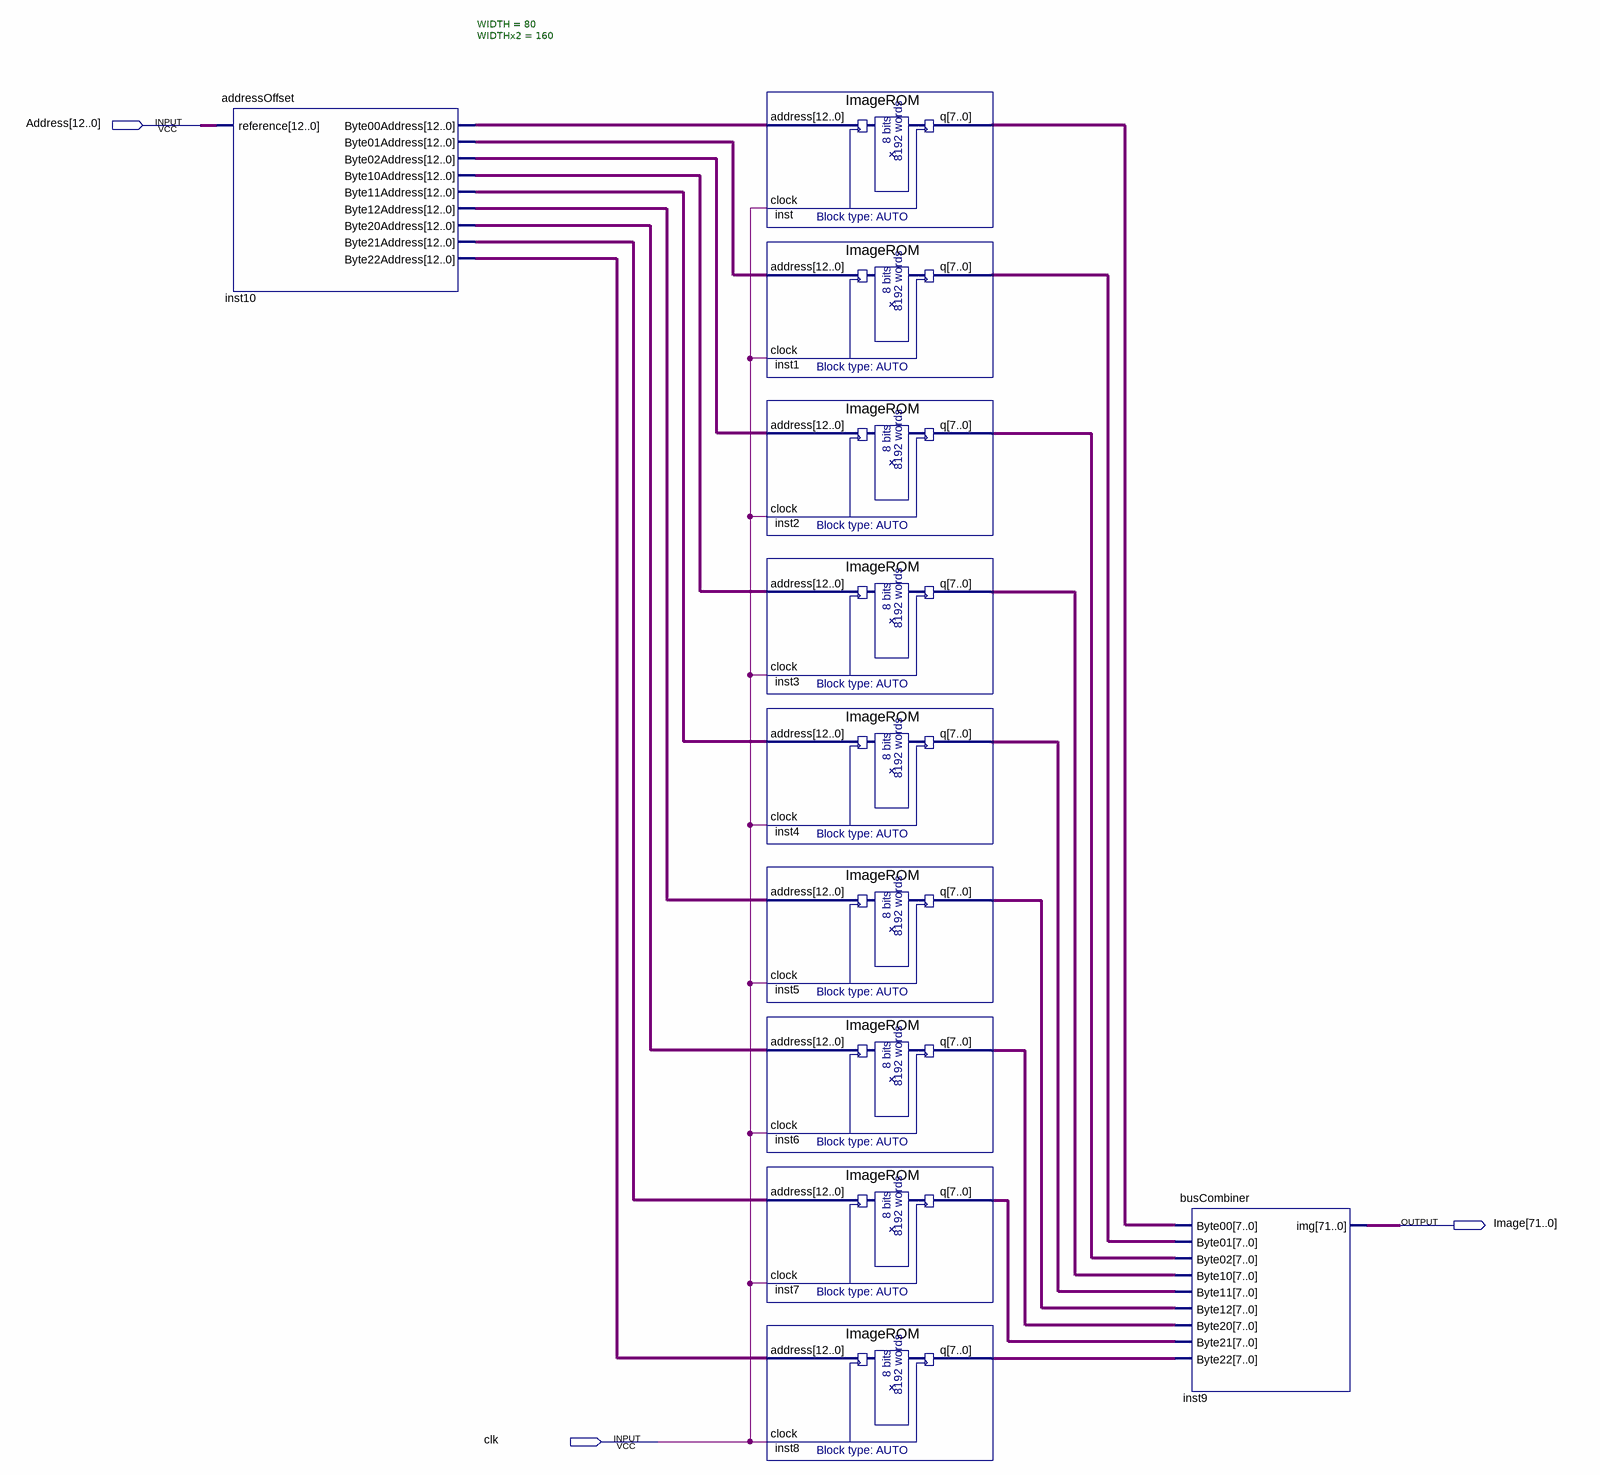
[diagram p0: schematic sheet]
// Quartus schematic Image.bdf as structural Verilog: 11 symbols, 3 pins
module Image (
  input  [12:0] Address,
  input  clk,
  output [71:0] Image
);

  wire [7:0] inst1_q, inst2_q, inst3_q, inst4_q, inst5_q, inst6_q, inst7_q, inst8_q, inst_q;
  wire [12:0] inst10_byte00address, inst10_byte01address, inst10_byte02address, inst10_byte10address,
       inst10_byte11address, inst10_byte12address, inst10_byte20address, inst10_byte21address,
       inst10_byte22address;

  addressOffset #(.WIDTH(80), .WIDTHx2(160)) inst10 (
    .reference(Address), .Byte00Address(inst10_byte00address), .Byte01Address(inst10_byte01address),
    .Byte02Address(inst10_byte02address), .Byte10Address(inst10_byte10address),
    .Byte11Address(inst10_byte11address), .Byte12Address(inst10_byte12address),
    .Byte20Address(inst10_byte20address), .Byte21Address(inst10_byte21address),
    .Byte22Address(inst10_byte22address));
  ImageROM inst (.address(inst10_byte00address), .clock(clk), .q(inst_q));
  ImageROM inst1 (.address(inst10_byte01address), .clock(clk), .q(inst1_q));
  ImageROM inst2 (.address(inst10_byte02address), .clock(clk), .q(inst2_q));
  ImageROM inst3 (.address(inst10_byte10address), .clock(clk), .q(inst3_q));
  ImageROM inst4 (.address(inst10_byte11address), .clock(clk), .q(inst4_q));
  ImageROM inst5 (.address(inst10_byte12address), .clock(clk), .q(inst5_q));
  ImageROM inst6 (.address(inst10_byte20address), .clock(clk), .q(inst6_q));
  ImageROM inst7 (.address(inst10_byte21address), .clock(clk), .q(inst7_q));
  ImageROM inst8 (.address(inst10_byte22address), .clock(clk), .q(inst8_q));
  busCombiner inst9 (
    .Byte00(inst_q), .Byte01(inst1_q), .Byte02(inst2_q), .Byte10(inst3_q), .Byte11(inst4_q),
    .Byte12(inst5_q), .Byte20(inst6_q), .Byte21(inst7_q), .Byte22(inst8_q), .img(Image));
endmodule
